# Altium schematic sheet Computation.SchDoc
size A4; SheetNumber: 3; SheetTotal: 7
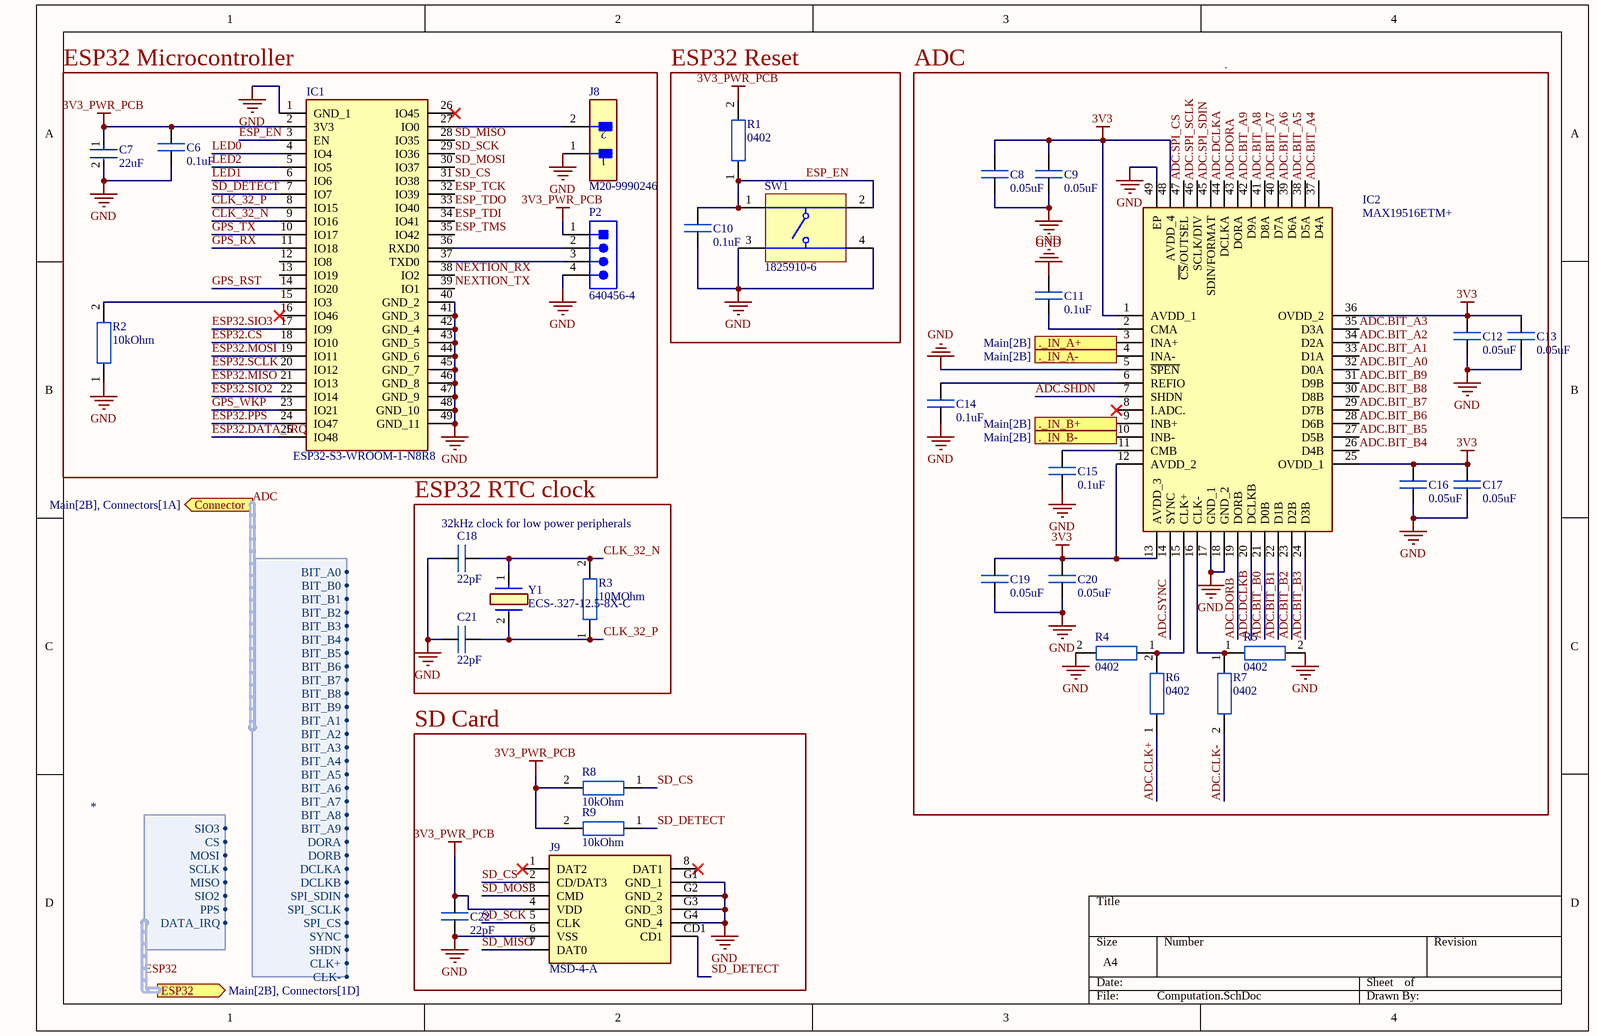
[diagram p0: Computation.SchDoc]

## Parts
C6  0.1uF  [0402_footprint]
C7  22uF  [FP-CL21-IPC_B]
C8  0.05uF  [0402_footprint]
C9  0.05uF  [0402_footprint]
C10  0.1uF  [0402_footprint]
C11  0.1uF  [0402_footprint]
C12  0.05uF  [0402_footprint]
C13  0.05uF  [0402_footprint]
C14  0.1uF  [0402_footprint]
C15  0.1uF  [0402_footprint]
C16  0.05uF  [0402_footprint]
C17  0.05uF  [0402_footprint]
C18  22pF  [0402_footprint]
C19  0.05uF  [0402_footprint]
C20  0.05uF  [0402_footprint]
C21  22pF  [0402_footprint]
C22  22pF  [0402_footprint]
IC1  ESP32-S3-WROOM-1-N8R8  [ESP32S3WROOM1N8R8]
IC2  MAX19516ETM+  [QFN50P700X700X80-49N]
J8  M20-9990246  [FP-M20-9990246-MFG]
J9  MSD-4-A  [MSD4A]
P2  640456-4  [TECO-640456-4]
R1  0402  [0402_footprint]
R2  10kOhm  [0402_footprint]
R3  10MOhm  [0402_footprint]
R4  0402  [0402_footprint]
R5  0402  [0402_footprint]
R6  0402  [0402_footprint]
R7  0402  [0402_footprint]
R8  10kOhm  [0402_footprint]
R9  10kOhm  [0402_footprint]
SW1  1825910-6  [TECO-1825910-6_V]
Y1  ECS-.327-12.5-8X-C  [ECS3271258XC]

## Blocks framed on the sheet
ESP32 Microcontroller: C6 C7 IC1 J8 P2 R2
ESP32 Reset: C10 R1 SW1
ADC: C8 C9 C11-C17 C19 C20 IC2 R4-R7
ESP32 RTC clock: C18 C21 R3 Y1
SD Card: C22 J9 R8 R9

## Ports
._IN_A+ (in, see Main[2B]), ._IN_A- (in, see Main[2B]), ._IN_B+ (in, see Main[2B]), ._IN_B- (in, see Main[2B]), Connector (out, harness Connector, see Main[2B], Connectors[1A]), ESP32 (out, harness *, see Main[2B], Connectors[1D])

## Harnesses
Connector: BIT_B1, BIT_B2, BIT_B3, BIT_B4, BIT_B5, BIT_B6, BIT_B7, BIT_B8, BIT_B9, BIT_A1, BIT_A2, BIT_A3, BIT_A4, BIT_A5, BIT_A6, BIT_A7, BIT_A8, BIT_A9, DORA, DORB, DCLKA, DCLKB, SPI_SDIN, SPI_SCLK, SPI_CS, SYNC, SHDN, BIT_B0, BIT_A0, CLK+, CLK-
*: SIO3, CS, MOSI, SCLK, MISO, SIO2, PPS, DATA_IRQ

## Nets
3V3: C8.2 C9.2 C12.2 C13.2 C16.2 C17.2 C19.2 C20.2 IC2.1(AVDD_1) IC2.12(AVDD_2) IC2.13(AVDD_3) IC2.25(OVDD_1) IC2.36(OVDD_2) IC2.48(AVDD_4)
3V3_PWR_PCB: C6.2 C7.1 C22.1 IC1.2(3V3) J9.4(VDD) P2.1 R1.2 R8.2 R9.2
GND: C6.1 C7.2 C8.1 C9.1 C10.1 C11.2 C12.1 C13.1 C14.1 C15.1 C16.1 C17.1 C18.2 C19.1 C20.1 C21.2 C22.2 IC1.1(GND_1) IC1.40(GND_2) IC1.41(GND_3) IC1.42(GND_4) IC1.43(GND_5) IC1.44(GND_6) IC1.45(GND_7) IC1.46(GND_8) IC1.47(GND_9) IC1.48(GND_10) IC1.49(GND_11) IC2.5(~{SPEN}) IC2.17(GND_1) IC2.18(GND_2) IC2.49(EP) J8.1 J9.6(VSS) J9.G1(GND_1) J9.G2(GND_2) J9.G3(GND_3) J9.G4(GND_4) P2.4 R2.1 R4.2 R5.2 SW1.3 SW1.4
._IN_A+: IC2.3(INA+) ; port ._IN_A+
._IN_A-: IC2.4(INA-) ; port ._IN_A-
._IN_B+: IC2.9(INB+) ; port ._IN_B+
._IN_B-: IC2.10(INB-) ; port ._IN_B-
ADC.BIT_A0: IC2.32(D0A)
ADC.BIT_A1: IC2.33(D1A)
ADC.BIT_A2: IC2.34(D2A)
ADC.BIT_A3: IC2.35(D3A)
ADC.BIT_A4: IC2.37(D4A)
ADC.BIT_A5: IC2.38(D5A)
ADC.BIT_A6: IC2.39(D6A)
ADC.BIT_A7: IC2.40(D7A)
ADC.BIT_A8: IC2.41(D8A)
ADC.BIT_A9: IC2.42(D9A)
ADC.BIT_B0: IC2.21(D0B)
ADC.BIT_B1: IC2.22(D1B)
ADC.BIT_B2: IC2.23(D2B)
ADC.BIT_B3: IC2.24(D3B)
ADC.BIT_B4: IC2.26(D4B)
ADC.BIT_B5: IC2.27(D5B)
ADC.BIT_B6: IC2.28(D6B)
ADC.BIT_B7: IC2.29(D7B)
ADC.BIT_B8: IC2.30(D8B)
ADC.BIT_B9: IC2.31(D9B)
ADC.CLK+: R6.1
ADC.CLK-: R7.2
ADC.DCLKA: IC2.44(DCLKA)
ADC.DCLKB: IC2.20(DCLKB)
ADC.DORA: IC2.43(DORA)
ADC.DORB: IC2.19(DORB)
ADC.SHDN: IC2.7(SHDN)
ADC.SPI_CS: IC2.47(~{CS}/OUTSEL)
ADC.SPI_SCLK: IC2.46(SCLK/DIV)
ADC.SPI_SDIN: IC2.45(SDIN/FORMAT)
ADC.SYNC: IC2.14(SYNC)
CLK_32_N: C18.1 IC1.9(IO16) R3.2 Y1.1(X1)
CLK_32_P: C21.1 IC1.8(IO15) R3.1 Y1.2(X2)
ESP32.CS: IC1.18(IO10)
ESP32.DATA_IRQ: IC1.25(IO48)
ESP32.MISO: IC1.21(IO13)
ESP32.MOSI: IC1.19(IO11)
ESP32.PPS: IC1.24(IO47)
ESP32.SCLK: IC1.20(IO12)
ESP32.SIO2: IC1.22(IO14)
ESP32.SIO3: IC1.17(IO9)
ESP_EN: C10.2 IC1.3(EN) R1.1 SW1.1 SW1.2
ESP_TCK: IC1.32(IO39)
ESP_TDI: IC1.34(IO41)
ESP_TDO: IC1.33(IO40)
ESP_TMS: IC1.35(IO42)
GPS_RST: IC1.14(IO20)
GPS_RX: IC1.11(IO18)
GPS_TX: IC1.10(IO17)
GPS_WKP: IC1.23(IO21)
LED0: IC1.4(IO4)
LED1: IC1.6(IO6)
LED2: IC1.5(IO5)
NEXTION_RX: IC1.38(IO2)
NEXTION_TX: IC1.39(IO1)
SD_CS: IC1.31(IO38) J9.2(CD/DAT3) R8.1
SD_DETECT: IC1.7(IO7) J9.CD1 R9.1
SD_MISO: IC1.28(IO35) J9.7(DAT0)
SD_MOSI: IC1.30(IO37) J9.3(CMD)
SD_SCK: IC1.29(IO36) J9.5(CLK)
NetC11_1: C11.1 IC2.2(CMA)
NetC14_2: C14.2 IC2.6(REFIO)
NetC15_2: C15.2 IC2.11(CMB)
NetIC1_15: IC1.15(IO3) R2.2
NetIC1_27: IC1.27(IO0) J8.2
NetIC1_36: IC1.36(RXD0) P2.2
NetIC1_37: IC1.37(TXD0) P2.3
NetIC2_15: IC2.15(CLK+) R4.1 R6.2
NetIC2_16: IC2.16(CLK-) R5.1 R7.1

Not connected (* = marked no-connect by the designer): IC1 12(IO8) 13(IO19) 16(IO46)* 26(IO45)*; IC2 8(I.ADC.)*; J9 1(DAT2)* 8(DAT1)*

## Buses and harness runs
harness ADC = port Connector
harness ESP32 = port ESP32

## Notes on the sheet
- .
- (near C18) 32kHz clock for low power peripherals

## Library data of the parts
C6 C8-C22 = Capacitor_0402: 0402 capacitor
C7 = CMP-13271-002087-1: CL21 Series 0805 22uF 6.3V ±20% Tolerance X5R Multilayer Ceramic Chip Capacitor; Max Operating Temperature: 85°C; Voltage Rating (DC): 6.3V; Thickness: 0.055inch; Packaging: Tape and Reel; Min Operating Temperature: -55°C; Depth: 1.25mm; Case/Package: 0805; Length: 2mm; Mount: Surface Mount; Width: 0.049inch; Radiation Hardening: No; Voltage Rating: 6.3V; Height: 1.25mm; Tolerance: 20%; Lead Free: Lead Free; Capacitance: 22uF; Package Quantity: 10000; Dielectric: X5R; ComponentLink1Description: Buy; ComponentLink1URL: https://www.mouser.lt/ProductDetail/Samsung-Electro-Mechanics/CL21A226MQQNNNF?qs=sGAEpiMZZMt7gvpyg0xT8gpCc%252Bo5qKWQjwV5CjV5FSg%3D
IC1 = ESP32-S3-WROOM-1-N8R8: Integrated Circuit; Manufacturer_Name: Espressif Systems; Datasheet Link: https://www.espressif.com/sites/default/files/documentation/esp32-s3-wroom-1_wroom-1u_datasheet_en.pdf; Height: 3.25mm; Manufacturer_Part_Number: ESP32-S3-WROOM-1-N8R8; Mouser Part Number: 356-EP32S3WROOM1N8R8; Mouser Price/Stock: https://www.mouser.co.uk/ProductDetail/Espressif-Systems/ESP32-S3-WROOM-1-N8R8?qs=7D1LtPJG0i3%2F28hKFavOpQ%3D%3D; ComponentLink1Description: S3 datasheet; ComponentLink1URL: https://www.espressif.com/sites/default/files/documentation/esp32-s3_datasheet_en.pdf; ComponentLink2Description: Wroom datasheet; ComponentLink2URL: https://www.espressif.com/sites/default/files/documentation/esp32-s3-wroom-1_wroom-1u_datasheet_en.pdf; ComponentLink3Description: Reference manual; ComponentLink3URL: https://www.espressif.com/sites/default/files/documentation/esp32-s3_technical_reference_manual_en.pdf
IC2 = MAX19516ETM+: Integrated Circuit; Manufacturer_Name: Maxim Integrated; Datasheet Link: https://datasheets.maximintegrated.com/en/ds/MAX19516.pdf; Height: 0.8mm; Manufacturer_Part_Number: MAX19516ETM+; Mouser Part Number: 700-MAX19516ETM; Mouser Price/Stock: https://www.mouser.co.uk/ProductDetail/Maxim-Integrated/MAX19516ETM%2b/?qs=1THa7WoU59FJ2JI%2FsSE3dA%3D%3D
J8 = CMP-15831-000009-1: CONN HEADER VERT 2POS 2.54MM; Manufacturer: Harwin; Conn Gender: Male; Conn Orientation: Vertical; Number Of Contacts: 2; Current Rating: 3A; ComponentLink2URL: https://cdn.harwin.com/pdfs/M20-999.pdf; ComponentLink2Description: Datasheet; Package: M20-9990246; Temperature: -40°C to +105°C; Octopart: https://octopart.com/m20-9990246-harwin-2590635; Mouser Description: 2.54mm (0.1") Pitch SIL Vertical PC Tail Pin Header, 6.1mm mating pin height, tin, 2 contacts; Temperature Range High: +105°C; Device Class L1: Connectors; RoHS: TRUE; Automotive: No; Height: 8.99mm; Number Of Rows: 1; Contact Material: Tin,Nickel; Category: Conn; Pitch: 2.54mm; Lead Free: Yes; Digikey Description: CONN HEADER VERT 2POS 2.54MM; Manufacturer Part Number: M20-9990246; Temperature Range Low: -40°C; Device Class L3: unset; Device Class L2: Headers and Wire Housings
J9 = MSD-4-A: Connector; Manufacturer_Name: CUI Devices; Datasheet Link: https://www.cuidevices.com/product/resource/pdf/msd-4-a.pdf; Height: 2mm; Manufacturer_Part_Number: MSD-4-A
P2 = CMP-2000-05419-1: Male Header, Pitch 2.54 mm, 1 x 4 Position, Height 10.03 mm, Tail Length 3.56 mm, RoHS, Bulk; Manufacturer: TE Connectivity; Material, Housing: Polyester; Primary Type: InterconnectSystem; Mount Angle: Vertical; Color, Housing: White; Current, Rating: 5 / A; Agency Approvals: CSA,UL; Contact Termination Area Plating: Tin; Temperature, Operating: -55to+105 / degC; Standards: RoHSCompliant,ELVCompliant,UL94V-0; Number of Positions: 4; Brand/Series: MTA-100Series; Angle: Straight; Pin Spacing: 0.1 / "; Material, Contact: CopperAlloy; Connector Type: MTA-100; Special Features: Pinstrip; Mounting Hole Size: 0.04 / "; Contact Centerline Spacing: 0.100 / in.; Voltage, Rating: 250 / V; Manufacturer URL: http://www.te.com/; Length, Pin: 0.14 / "; Length, Overall: 0.4 / "; Color: White; Flammability Rating: UL94V-0; Mounting Type: PCMount; Termination: Solder; Datasheet URL: https://datasheet.ciiva.com/16286/eng-ds-82056-mta-0608-16286228.pdf; Number of Contacts: 4; Contact Shape: Square; Contact Mating Area Plating: Tin; Length, Terminal Post: 0.14 / in.; Size, Post: 0.025 / in.; Contact Plating: Tin; Type: PCBPlug; Datasheet Version: Dec-14; Number of Rows: 1
R1-R9 = Resistor_0402: 0402 resistor
SW1 = CMP-1684-00021-1: Tact Switch, SPST-NO, 0.05 A, -35 to 85 degC, 4-Pin THD, RoHS, Bulk; Manufacturer: TE Connectivity; Maximum Contact Resistance: 100mOhm; Mechanical Life: 100000Cycles; Bushing Type: Unthreaded; Switch Configuration: OFF(ON); Maximum DC Voltage Rating: 24V; Contact Rating @ Voltage: 0.05A@24VDC; Actuator Color: Black; Body Orientation: Straight; Function: MomentaryContact; Illumination: N/R; Actuator Style: RoundButton; Actuator Material: PolybutyleneTerephthalate; Dielectric Strength: 500VAC; Pole Throw Configuration: SPST; Actuator Length: 1.4mm; Product Weight: N/A; Contact Material: CopperAlloy; Housing Material: N/A; Terminal Type: PCPins; Minimum Insulation Resistance: 100MOhm; Package Description: 4-Pin Through Hole Device, Body 5.99 x 5.99 mm, Pitch 6.5 mm; Part No: 1825910-6; Package Reference: THD; Base Material: N/A; Manufacturer URL: http://www.te.com; Contact Plating: Silver; RoHS: Yes; Datasheet Version: Rev. C9; Electrical Life: 100000Cycles; Maximum AC Voltage Rating: N/A; Thread Size: N/R; Operating Temperature: -35to85C; Mounting: ThroughHole; Dimension: 5.99x5mm; Datasheet URL: http://www.te.com/commerce/DocumentDelivery/DDEController?Action=showdoc&DocId=Customer+Drawing%7F1825910%7FC9%7Fpdf%7FEnglish%7FENG_CD_1825910_C9.pdf%7F1825910-6; Family: 1825910; Seal Location: N/A; Seal Description: N/A; Packaging: N/A
Y1 = ECS-.327-12.5-8X-C: Crystal or Oscillator; Manufacturer_Name: ECS; Datasheet Link: https://www.mouser.in/datasheet/2/122/ECS__327_12_5_13X_C-1919094.pdf; Height: 6.2mm; Manufacturer_Part_Number: ECS-.327-12.5-8X-C; Mouser Part Number: 520-ECS-327-12.58X-C; Mouser Price/Stock: https://www.mouser.co.uk/ProductDetail/ECS/ECS-.327-12.5-8X-C?qs=vmHwEFxEFR8ooxxsTMgFbw%3D%3D; ComponentLink1Description: Buy; ComponentLink1URL: https://www.mouser.lt/ProductDetail/ECS/ECS-.327-12.5-8X-C?qs=vmHwEFxEFR8ooxxsTMgFbw%3D%3D; ComponentLink2Description: Datasheet; ComponentLink2URL: https://www.mouser.lt/datasheet/2/122/ECS-.327-12.5-8X-C-1841202.pdf